# Altium schematic sheet GPIO.SchDoc
size A4
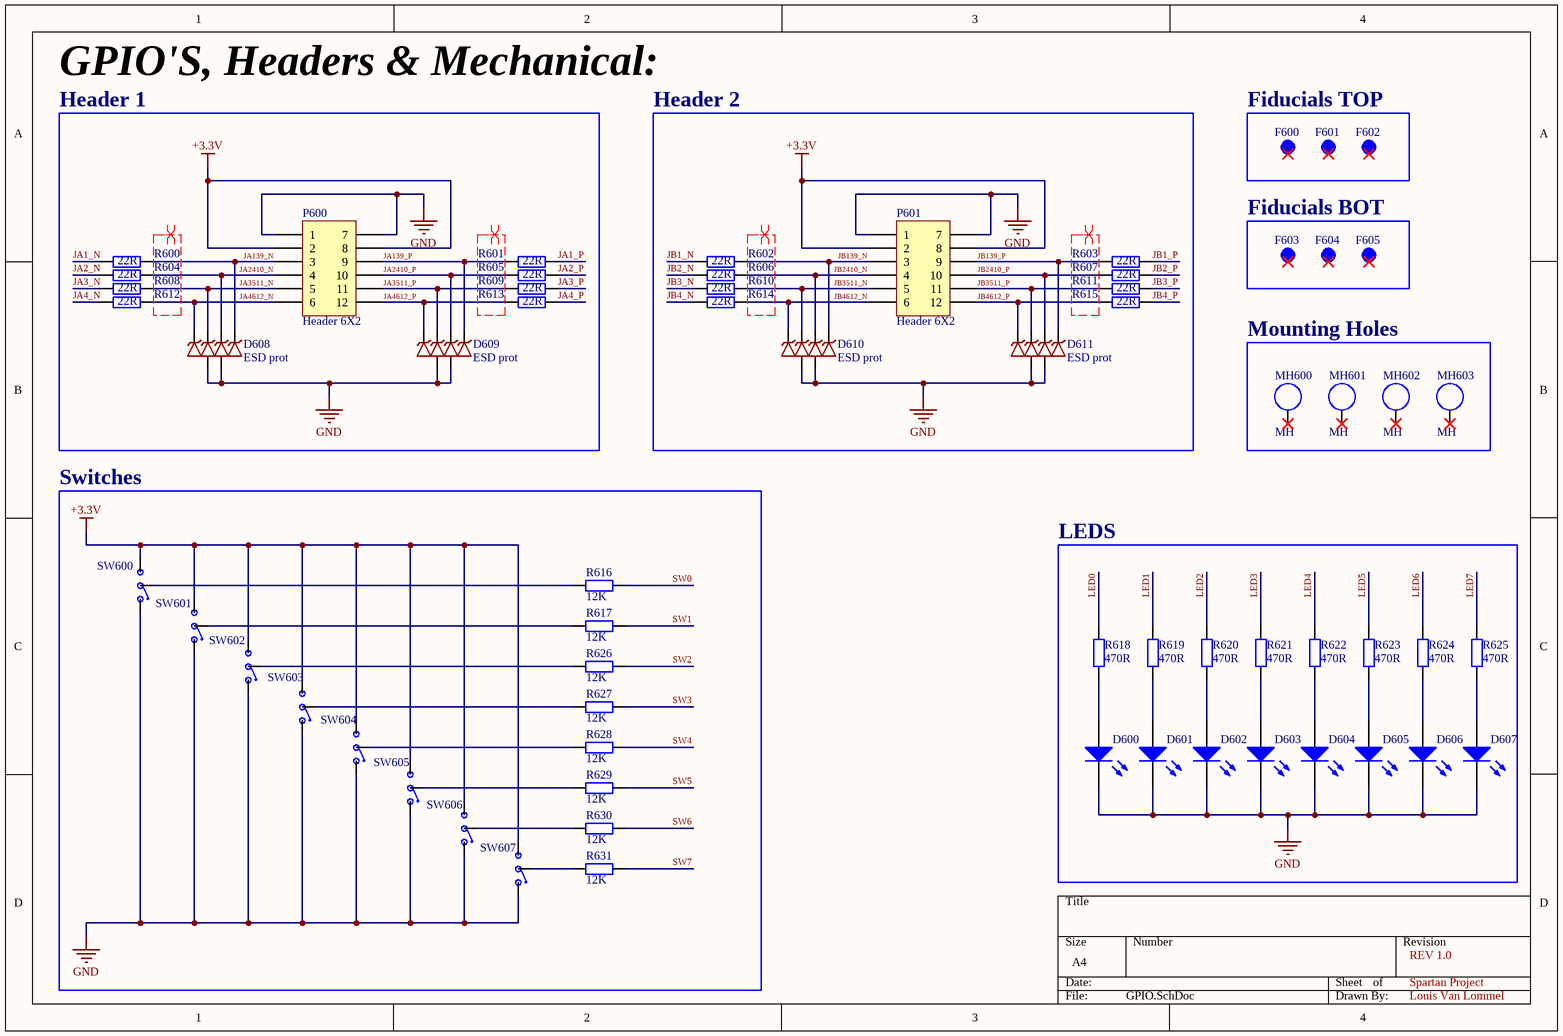
[diagram p0: GPIO.SchDoc]

## Parts
D600  LED  [LED_0603]  (value not drawn)
D601  LED  [LED_0603]  (value not drawn)
D602  LED  [LED_0603]  (value not drawn)
D603  LED  [LED_0603]  (value not drawn)
D604  LED  [LED_0603]  (value not drawn)
D605  LED  [LED_0603]  (value not drawn)
D606  LED  [LED_0603]  (value not drawn)
D607  LED  [LED_0603]  (value not drawn)
D608  ESD prot  [SOT457]
D609  ESD prot  [SOT457]
D610  ESD prot  [SOT457]
D611  ESD prot  [SOT457]
F600  Fiducial  [Fiducial30mil]  (value not drawn)  (no BOM)
F601  Fiducial  [Fiducial30mil]  (value not drawn)  (no BOM)
F602  Fiducial  [Fiducial30mil]  (value not drawn)  (no BOM)
F603  Fiducial  [Fiducial30mil]  (value not drawn)  (no BOM)
F604  Fiducial  [Fiducial30mil]  (value not drawn)  (no BOM)
F605  Fiducial  [Fiducial30mil]  (value not drawn)  (no BOM)
MH600  MH  [MH3.2mm]  (no BOM)
MH601  MH  [MH3.2mm]  (no BOM)
MH602  MH  [MH3.2mm]  (no BOM)
MH603  MH  [MH3.2mm]  (no BOM)
P600  Header 6X2  [HDR2X6_CEN]
P601  Header 6X2  [HDR2X6_CEN]
R600  value 22R  [RES_0603]  (hidden comment: 22)
R601  value 22R  [RES_0603]  (hidden comment: 22)
R602  value 22R  [RES_0603]  (hidden comment: 22)
R603  value 22R  [RES_0603]  (hidden comment: 22)
R604  value 22R  [RES_0603]  (hidden comment: 22)
R605  value 22R  [RES_0603]  (hidden comment: 22)
R606  value 22R  [RES_0603]  (hidden comment: 22)
R607  value 22R  [RES_0603]  (hidden comment: 22)
R608  value 22R  [RES_0603]  (hidden comment: 22)
R609  value 22R  [RES_0603]  (hidden comment: 22)
R610  value 22R  [RES_0603]  (hidden comment: 22)
R611  value 22R  [RES_0603]  (hidden comment: 22)
R612  value 22R  [RES_0603]  (hidden comment: 22)
R613  value 22R  [RES_0603]  (hidden comment: 22)
R614  value 22R  [RES_0603]  (hidden comment: 22)
R615  value 22R  [RES_0603]  (hidden comment: 22)
R616  12K  [RES_0603]
R617  12K  [RES_0603]
R618  value 470R  [RES_0603]  (hidden comment: 470)
R619  value 470R  [RES_0603]  (hidden comment: 470)
R620  value 470R  [RES_0603]  (hidden comment: 470)
R621  value 470R  [RES_0603]  (hidden comment: 470)
R622  value 470R  [RES_0603]  (hidden comment: 470)
R623  value 470R  [RES_0603]  (hidden comment: 470)
R624  value 470R  [RES_0603]  (hidden comment: 470)
R625  value 470R  [RES_0603]  (hidden comment: 470)
R626  12K  [RES_0603]
R627  12K  [RES_0603]
R628  12K  [RES_0603]
R629  12K  [RES_0603]
R630  12K  [RES_0603]
R631  12K  [RES_0603]
SW600  SPDT SW  [SPDT SWITCH]  (value not drawn)
SW601  SPDT SW  [SPDT SWITCH]  (value not drawn)
SW602  SPDT SW  [SPDT SWITCH]  (value not drawn)
SW603  SPDT SW  [SPDT SWITCH]  (value not drawn)
SW604  SPDT SW  [SPDT SWITCH]  (value not drawn)
SW605  SPDT SW  [SPDT SWITCH]  (value not drawn)
SW606  SPDT SW  [SPDT SWITCH]  (value not drawn)
SW607  SPDT SW  [SPDT SWITCH]  (value not drawn)

## Blocks framed on the sheet
Header 1: D608 D609 P600 R600 R601 R604 R605 R608 R609 R612 R613
Header 2: D610 D611 P601 R602 R603 R606 R607 R610 R611 R614 R615
Fiducials TOP: F600-F602
Fiducials BOT: F603-F605
Mounting Holes: MH600-MH603
Switches: R616 R617 R626-R631 SW600-SW607
LEDS: D600-D607 R618-R625

## Nets
+3.3V: P600.2 P600.8 P601.2 P601.8 SW600.1 SW601.1 SW602.1 SW603.1 SW604.1 SW605.1 SW606.1 SW607.1
GND: D600.2(K) D601.2(K) D602.2(K) D603.2(K) D604.2(K) D605.2(K) D606.2(K) D607.2(K) D608.5 D608.6 D609.5 D609.6 D610.5 D610.6 D611.5 D611.6 P600.1 P600.7 P601.1 P601.7 SW600.3 SW601.3 SW602.3 SW603.3 SW604.3 SW605.3 SW606.3 SW607.3
JA1_N: R600.2
JA1_P: R601.1
JA2_N: R604.2
JA2_P: R605.1
JA3_N: R608.2
JA3_P: R609.1
JA4_N: R612.2
JA4_P: R613.1
JA139_N: D608.4 P600.3 R600.1
JA139_P: D609.4 P600.9 R601.2
JA2410_N: D608.3 P600.4 R604.1
JA2410_P: D609.3 P600.10 R605.2
JA3511_N: D608.2 P600.5 R608.1
JA3511_P: D609.2 P600.11 R609.2
JA4612_N: D608.1 P600.6 R612.1
JA4612_P: D609.1 P600.12 R613.2
JB1_N: R602.2
JB1_P: R603.1
JB2_N: R606.2
JB2_P: R607.1
JB3_N: R610.2
JB3_P: R611.1
JB4_N: R614.2
JB4_P: R615.1
JB139_N: D610.4 P601.3 R602.1
JB139_P: D611.4 P601.9 R603.2
JB2410_N: D610.3 P601.4 R606.1
JB2410_P: D611.3 P601.10 R607.2
JB3511_N: D610.2 P601.5 R610.1
JB3511_P: D611.2 P601.11 R611.2
JB4612_N: D610.1 P601.6 R614.1
JB4612_P: D611.1 P601.12 R615.2
LED0: R618.2
LED1: R619.2
LED2: R620.2
LED3: R621.2
LED4: R622.2
LED5: R623.2
LED6: R624.2
LED7: R625.2
SW0: R616.1
SW1: R617.1
SW2: R626.1
SW3: R627.1
SW4: R628.1
SW5: R629.1
SW6: R630.1
SW7: R631.1
NetD600_1: D600.1(A) R618.1
NetD601_1: D601.1(A) R619.1
NetD602_1: D602.1(A) R620.1
NetD603_1: D603.1(A) R621.1
NetD604_1: D604.1(A) R622.1
NetD605_1: D605.1(A) R623.1
NetD606_1: D606.1(A) R624.1
NetD607_1: D607.1(A) R625.1
NetR616_2: R616.2 SW600.2
NetR617_2: R617.2 SW601.2
NetR626_2: R626.2 SW602.2
NetR627_2: R627.2 SW603.2
NetR628_2: R628.2 SW604.2
NetR629_2: R629.2 SW605.2
NetR630_2: R630.2 SW606.2
NetR631_2: R631.2 SW607.2

Not connected (* = marked no-connect by the designer): F600 1*; F601 1*; F602 1*; F603 1*; F604 1*; F605 1*; MH600 1*; MH601 1*; MH602 1*; MH603 1*

## Layout directives
differential pair: (no net found under the mark)

## Notes on the sheet
- GPIO'S, Headers & Mechanical:
- REV 1.0
- Spartan Project
- Louis Van Lommel

## Library data of the parts
D600-D607 = LED0: Typical INFRARED GaAs LED; Published: 8-Jun-2000; LatestRevisionDate: 08-Jul-2005; LatestRevisionNote: Mech Layer 1 removed.; PackageReference: LED-0; Publisher: Altium Limited; PackageDescription: LED; 2 Leads
D608-D611 = ESD prot: NEXPERIA BZA462A,125
F600-F605 = Fiducial: 30mil Fiducial
MH600-MH603 = MH: 3.2mm mounting hole
P600 P601 = Header 6X2A: Header, 6-Pin, Dual row; LatestRevisionDate: 17-Jul-2002; LatestRevisionNote: Re-released for DXP Platform.; Publisher: Altium Limited
R600-R631 = Res2: Resistor; Published: 8-Jun-2000; LatestRevisionDate: 17-Jul-2002; LatestRevisionNote: Re-released for DXP Platform.; PackageReference: AXIAL-0.4; Publisher: Altium Limited; PackageDescription: Axial Device, Thru-Hole; 2 Leads; 0.4 in Pin Spacing
  R616 R617 R626-R631: Value: 12K